# Altium schematic sheet 23-TEST AUTOMATION.SchDoc
size 513 x 386 mm
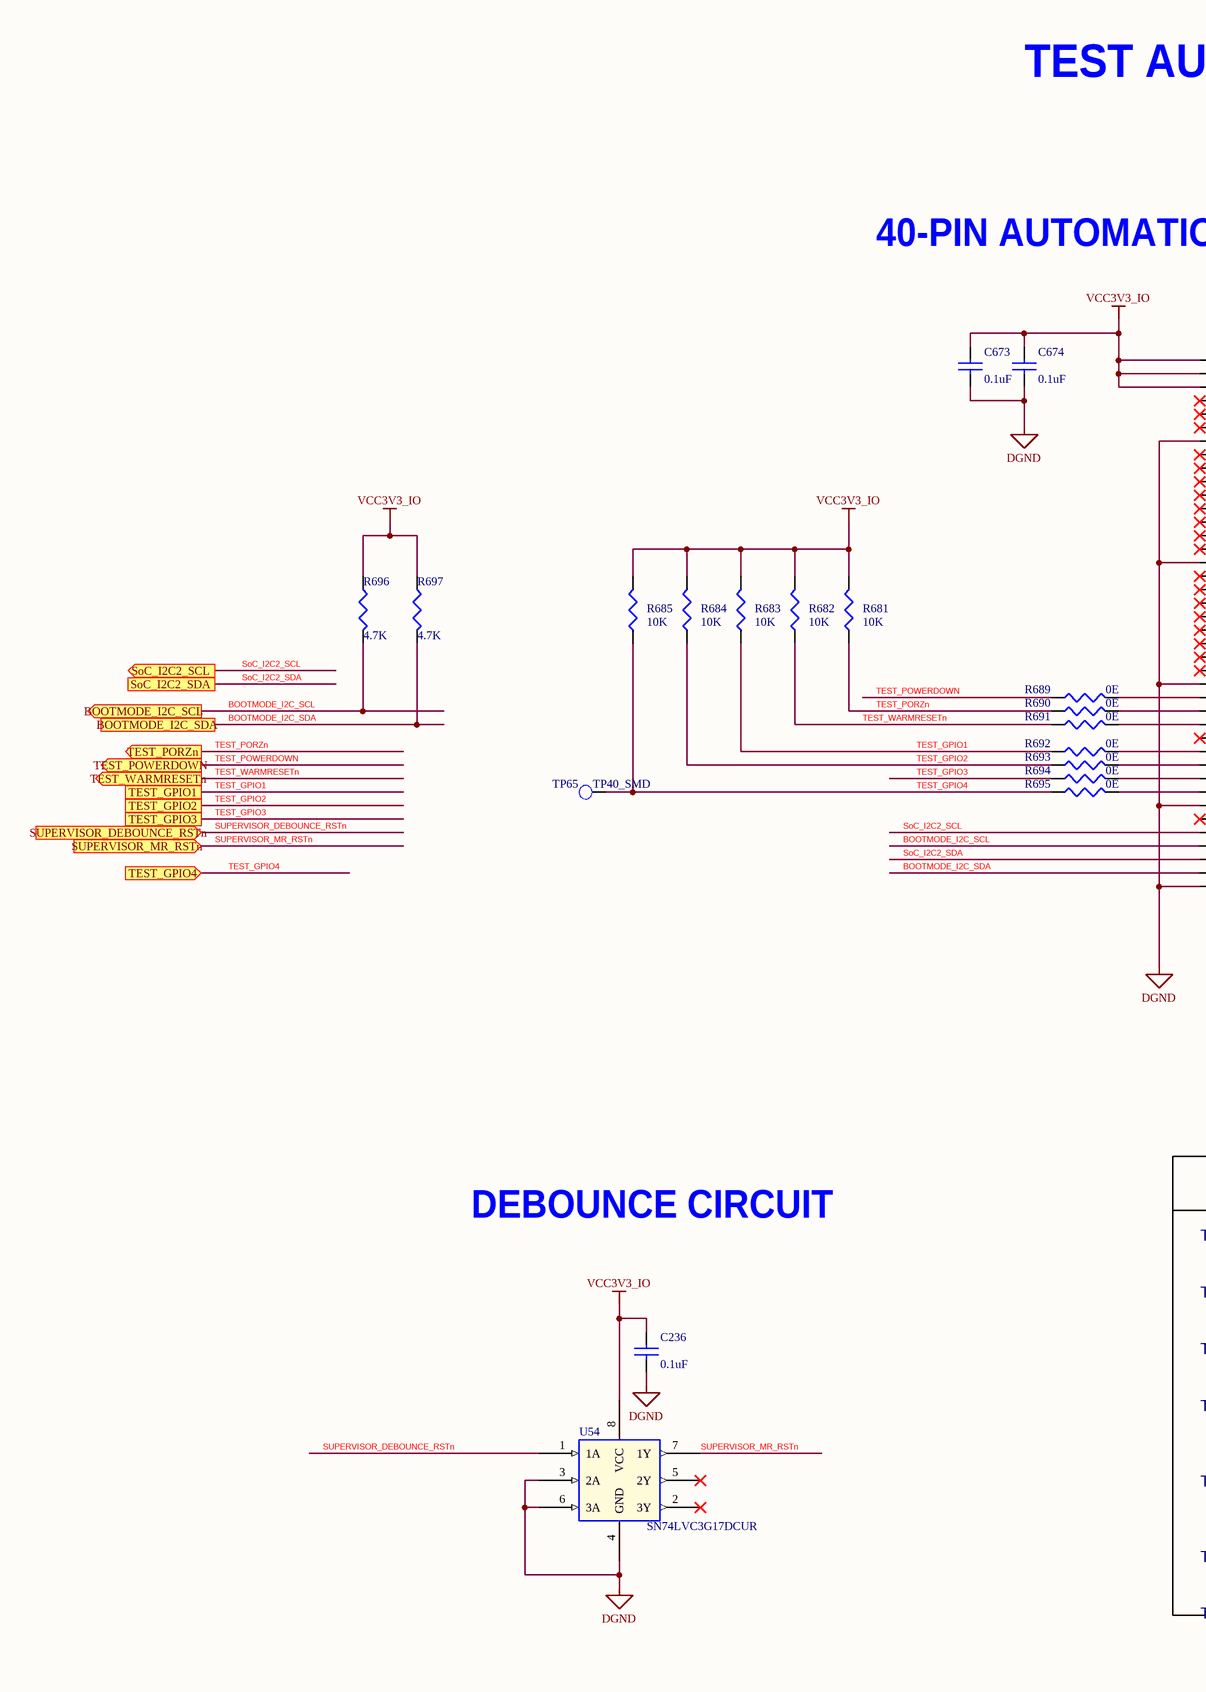
[diagram p0: 23-TEST AUTOMATION.SchDoc, left]
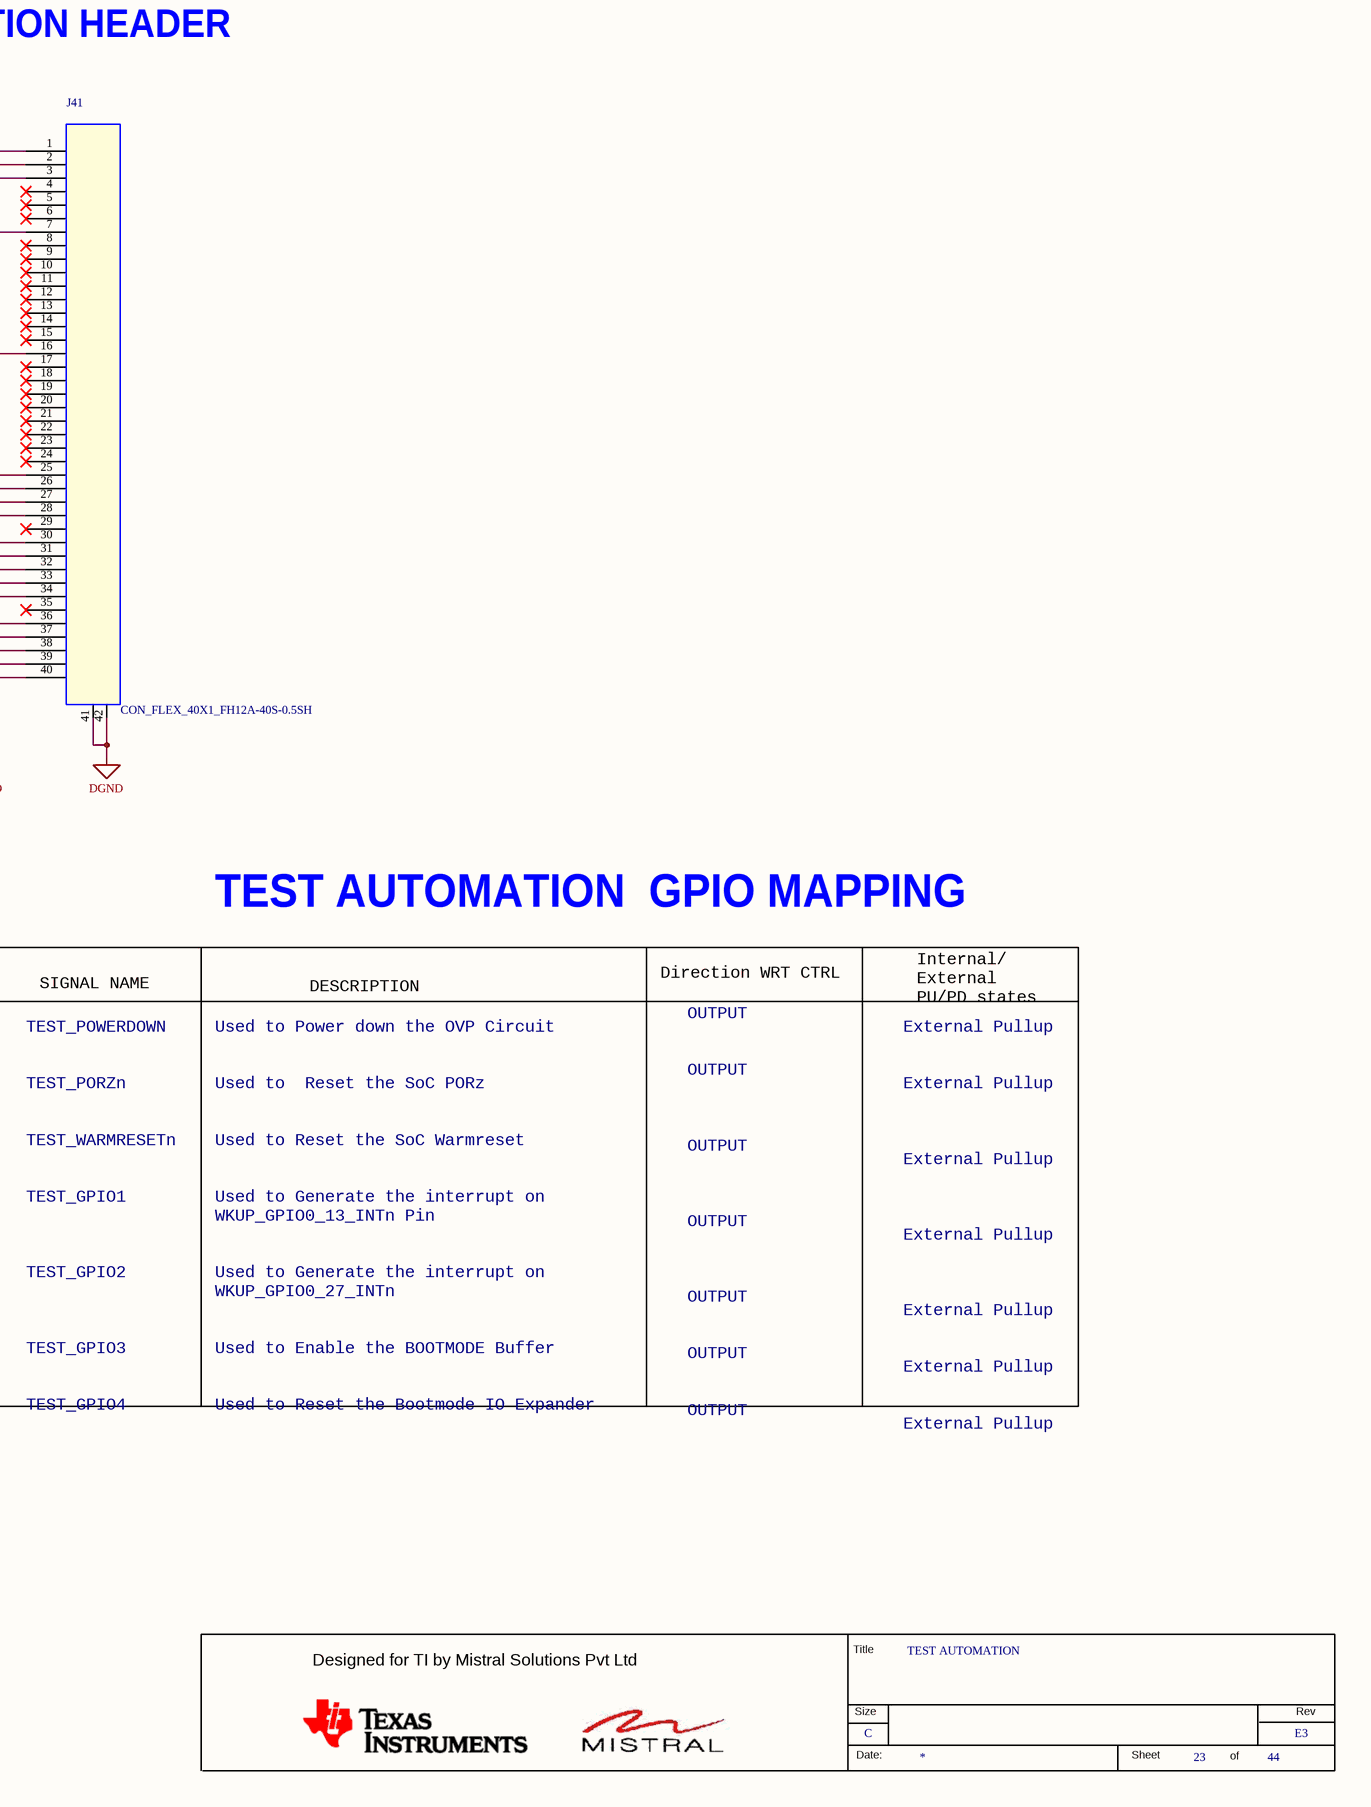
[diagram p1: 23-TEST AUTOMATION.SchDoc, right]

## Parts
*  RevCode: E3  Title: TEST AUTOMATION  Page Size: C  Page Number: 23  Page Count: 44  (hidden comment: MISTRAL_TITLEBLK_CSIZE)  (graphical)
C236  0.1uF  [CAP0201_0-5]
C673  0.1uF  [CAP0201_0-5]
C674  0.1uF  [CAP0201_0-5]
J41  CON_FLEX_40X1_FH12A-40S-0.5SH  [CON_FLEX40X1_FH12A_S_R_S]
R681  10K  [RES0402_0-5]
R682  10K  [RES0402_0-5]
R683  10K  [RES0402_0-5]
R684  10K  [RES0402_0-5]
R685  10K  [RES0402_0-5]
R689  0E  [RES0402_0-5]
R690  0E  [RES0402_0-5]
R691  0E  [RES0402_0-5]
R692  0E  [RES0402_0-5]
R693  0E  [RES0402_0-5]
R694  0E  [RES0402_0-5]
R695  0E  [RES0402_0-5]
R696  4.7K  [RES0402]
R697  4.7K  [RES0402]
TP65  TP40_SMD  [TP40_SMD]
U54  SN74LVC3G17DCUR  [VSSOP8_19-68_85X95_0-9]

## Ports
BOOTMODE_I2C_SCL (out), BOOTMODE_I2C_SDA, SoC_I2C2_SCL (out), SoC_I2C2_SDA, SUPERVISOR_DEBOUNCE_RSTn (in), SUPERVISOR_MR_RSTn (in), TEST_GPIO1, TEST_GPIO2, TEST_GPIO3, TEST_GPIO4 (in), TEST_PORZn (out), TEST_POWERDOWN (out), TEST_WARMRESETn (out)

## Nets
DGND: C236.2 C673.2 C674.2 J41.7 J41.16 J41.25 J41.34 J41.40 J41.41 J41.42 U54.3(2A) U54.4(GND) U54.6(3A)
VCC3V3_IO: C236.1 C673.1 C674.1 J41.1 J41.2 J41.3 R681.2 R682.2 R683.2 R684.2 R685.2 R696.1 R697.1 U54.8(VCC)
BOOTMODE_I2C_SCL: J41.37 R696.2 ; port BOOTMODE_I2C_SCL
BOOTMODE_I2C_SDA: J41.39 R697.2 ; port BOOTMODE_I2C_SDA
SoC_I2C2_SCL: J41.36 ; port SoC_I2C2_SCL
SoC_I2C2_SDA: J41.38 ; port SoC_I2C2_SDA
SUPERVISOR_DEBOUNCE_RSTn: U54.1(1A) ; port SUPERVISOR_DEBOUNCE_RSTn
SUPERVISOR_MR_RSTn: U54.7(1Y) ; port SUPERVISOR_MR_RSTn
TEST_GPIO1: R683.1 R692.1 ; port TEST_GPIO1
TEST_GPIO2: R684.1 R693.1 ; port TEST_GPIO2
TEST_GPIO3: R694.1 ; port TEST_GPIO3
TEST_GPIO4: R685.1 R695.1 TP65.1(TP) ; port TEST_GPIO4
TEST_PORZn: R681.1 R690.1 ; port TEST_PORZn
TEST_POWERDOWN: R689.1 ; port TEST_POWERDOWN
TEST_WARMRESETn: R682.1 R691.1 ; port TEST_WARMRESETn
NetJ41_26: J41.26 R689.2
NetJ41_27: J41.27 R690.2
NetJ41_28: J41.28 R691.2
NetJ41_30: J41.30 R692.2
NetJ41_31: J41.31 R693.2
NetJ41_32: J41.32 R694.2
NetJ41_33: J41.33 R695.2

Not connected (* = marked no-connect by the designer): J41 4* 5* 6* 8* 9* 10* 11* 12* 13* 14* 15* 17* 18* 19* 20* 21* 22* 23* 24* 29* 35*; U54 2(3Y)* 5(2Y)*

## Notes on the sheet
- TEST AUTOMATION
- 40-PIN AUTOMATION HEADER
- TEST AUTOMATION  GPIO MAPPING
- SIGNAL NAME
- Direction WRT CTRL
- Internal/
  External
  PU/PD states
- DEBOUNCE CIRCUIT
- DESCRIPTION
- TEST_POWERDOWN
  TEST_PORZn
  TEST_WARMRESETn
  TEST_GPIO1
  TEST_GPIO2
  TEST_GPIO3
  TEST_GPIO4
- OUTPUT
  OUTPUT
  OUTPUT
  OUTPUT
  OUTPUT
  OUTPUT
  OUTPUT
- External Pullup
  External Pullup
  External Pullup
  External Pullup
  External Pullup
  External Pullup
  External Pullup
- Used to Power down the OVP Circuit
  Used to  Reset the SoC PORz
  Used to Reset the SoC Warmreset
  Used to Generate the interrupt on
  WKUP_GPIO0_13_INTn Pin
  Used to Generate the interrupt on
  WKUP_GPIO0_27_INTn
  Used to Enable the BOOTMODE Buffer
  Used to Reset the Bootmode IO Expander
- (in symbol MISTRAL_TITLEBLK_CSIZE) Title; Designed for TI by Mistral Solutions Pvt Ltd; Size; Rev; Date:; Sheet; of

## Library data of the parts
* = MISTRAL_TITLEBLK_CSIZE: Issue: 1.0; Page Create Date: March  8, 1995; Page Modify Date: *
C236 C674 = CAP_Dup5: CAP CERAMIC 0.1uF 16V 10% X5R 0201; Mistral Part No: 120009030072-R; Mfr_name: MURATA; Mfr_part_number: GRM033R61C104KE84J; Part_type: CAPACITORS\CERAMIC; Project: TI_MAXIE_CPB; Wattage: NA; Customs_HS_Code: 85322990; Custom_Duty: 15%; Library Ref: CAP; Tolerance: 10%; Voltage: 16V; Package: 0201; Distributor_name: DIGIKEY; Distributor_part_number: 490-16742-1-ND; Height: 0.33MM; Weight: 0.33mg; Temperature: -55°C+85°C; Datasheet: Y:\MIS_DATABASE\DATASHEETS\CAPACITORS\GRM033R61C104KE84.PDF; Crtd /date: MANIRAJA/120218; Chkd/date: MANIRAJA/120218; MECHANICAL 3D STEP FILE: CAP0201_0-5; PCB Footprint: CAP0201_0-5
C673 = CAP_Dup5: CAP CERAMIC 0.1uF 16V 10% X5R 0201; Part_type: CAPACITORS\CERAMIC; Mfr_part_number: GRM033R61C104KE84J; Mfr_name: MURATA; Mistral Part No: 120009030072-R; Custom_Duty: 15%; Customs_HS_Code: 85322990; Wattage: NA; Project: TI_MAXIE_CPB; Library Ref: CAP; MECHANICAL 3D STEP FILE: CAP0201_0-5; Chkd/date: MANIRAJA/120218; Crtd /date: MANIRAJA/120218; Datasheet: Y:\MIS_DATABASE\DATASHEETS\CAPACITORS\GRM033R61C104KE84.PDF; Temperature: -55°C+85°C; Weight: 0.33mg; Height: 0.33MM; Distributor_part_number: 490-16742-1-ND; Distributor_name: DIGIKEY; Package: 0201; Voltage: 16V; Tolerance: 10%; PCB Footprint: CAP0201_0-5
J41 = CON_FLEX_40X1_FH12A-40S-0.5SH: CON FPC 40X1 0.50MM PITCH RT TOP SMD; Part_type: CONNECTOR\FPC; Mfr_part_number: FH12A-40S-0.5SH(55); Mfr_name: HIROSE ELECTRIC EUROPE; Mistral Part No: 150009030176-R; Remarks: CON_FLEX40X1_FH12A_S_R_S_PMP take this footprint for PMP LCD BOARD/ROHS INFORMATION ADDED(BAVISH/270911)Mistral part# updated with -R.; Custom_Duty: 24%; Customs_HS_Code: 85369090; Project: PMP LCD BOARD; Library Ref: CON_FLEX_40X1_FH12A-40S-0.5SH; Chkd/date: SHREESHAIL/201106; Crtd /date: MAZHAR/171106; Datasheet: Y:\MIS_DATABASE\DATASHEETS\CONNECTORS\FH12SERIES.PDF; Height: 2.00MM; Distributor_part_number: HFK40CT-ND; Distributor_name: DIGIKEY; Package: SMD; PCB Footprint: CON_FLEX40X1_FH12A_S_R_S
R681-R685 = RESISTOR_Dup5: RES 10K 1/16W 5% 0402; Mistral Part No: 110009030208-R; Mfr_name: YAGEO AMERICA; Mfr_part_number: RC0402JR-0710KL; Part_type: RESISTORS\FIXED; Project: HSE; Voltage: NA; Customs_HS_Code: 85332119; Custom_Duty: 15%; Footprint Path: Y:\MIS_DATABASE\Library\ALTIUM_TOOL\PCB_FOOTPRINTS\Altium_Footprint_Lib.PcbLib; Library Path: Y:\MIS_DATABASE\Library\ALTIUM_TOOL\SCHEMATICS_PARTS\MS_DISCRETE_Library.schlib; Footprint Ref: RES0402_0-5; Library Ref: RESISTOR; Tolerance: 5%; Wattage: 1/16W; Package: 0402; Distributor_name: DIGIKEY; Distributor_part_number: 311-10KJRCT-ND; Height: 0.40MM; Weight: 0.65mg; Temperature: -55°C+155°C; Datasheet: Y:\MIS_DATABASE\DATASHEETS\RESISTORS\YAGEO-RC0402.PDF; Crtd /date: MAZHAR/230805; Chkd/date: VASANTHA/061216; RoHS: Pb-Free; MECHANICAL 3D STEP FILE: RES0402_0-5; PCB Footprint: RES0402_0-5
R689 R691-R693 R695 = RESISTOR_Dup4: RES 0E 1/16W 0402; Part_type: RESISTORS\FIXED; Mfr_part_number: CRCW04020000Z0ED; Mfr_name: VISHAY; Mistral Part No: 110010080019-P; Custom_Duty: 15%; Customs_HS_Code: 85332119; Voltage: NA; Project: PB_BUGBASE; Footprint Path: Y:\MIS_DATABASE\Library\ALTIUM_TOOL\PCB_FOOTPRINTS\Altium_Footprint_Lib.PcbLib; Library Path: Y:\MIS_DATABASE\Library\ALTIUM_TOOL\SCHEMATICS_PARTS\MS_DISCRETE_Library.schlib; Footprint Ref: RES0402_0-5; Library Ref: RESISTOR; RoHS: Pb-Free; Chkd/date: VASANTHA/201216; Crtd /date: MUDDU/190810; Datasheet: Y:\MIS_DATABASE\DATASHEETS\RESISTORS\CRCW0603.PDF; Temperature: -55°C+155°C; Weight: 0.65g/1000pcs; Height: 0.40MM; Distributor_part_number: 541-0.0JCT-ND; Distributor_name: DIGIKEY; Package: 0402; Wattage: 1/16W; Tolerance: NA; MECHANICAL 3D STEP FILE: RES0402_0-5; PCB Footprint: RES0402_0-5
R690 R694 = RESISTOR_Dup4: RES 0E 1/16W 0402; Mistral Part No: 110010080019-P; Mfr_name: VISHAY; Mfr_part_number: CRCW04020000Z0ED; Part_type: RESISTORS\FIXED; Project: PB_BUGBASE; Tolerance: NA; Customs_HS_Code: 85332119; Custom_Duty: 15%; Footprint Path: Y:\MIS_DATABASE\Library\ALTIUM_TOOL\PCB_FOOTPRINTS\Altium_Footprint_Lib.PcbLib; Library Path: Y:\MIS_DATABASE\Library\ALTIUM_TOOL\SCHEMATICS_PARTS\MS_DISCRETE_Library.schlib; Footprint Ref: RES0402_0-5; Library Ref: RESISTOR; Voltage: NA; Wattage: 1/16W; Package: 0402; Distributor_name: DIGIKEY; Distributor_part_number: 541-0.0JCT-ND; Height: 0.40MM; Weight: 0.65g/1000pcs; Temperature: -55°C+155°C; Datasheet: Y:\MIS_DATABASE\DATASHEETS\RESISTORS\CRCW0603.PDF; Crtd /date: MUDDU/190810; Chkd/date: VASANTHA/201216; RoHS: Pb-Free; MECHANICAL 3D STEP FILE: RES0402_0-5; PCB Footprint: RES0402_0-5
R696 R697 = RESISTOR_Dup5: RES 4.7K 1/16W 5% 0402; Part_type: RESISTORS\FIXED; Mfr_part_number: RC0402JR-074K7L; Mfr_name: YAGEO AMERICA; Mistral Part No: 110009030792-R; Custom_Duty: 15%; Customs_HS_Code: 85332119; Voltage: NA; Project: TMDXCSK368; Library Ref: RESISTOR; Chkd/date: VASANTHA/130516; Crtd /date: VASANTHA/130516; Datasheet: Y:\MIS_DATABASE\DATASHEETS\RESISTORS\YAGEO-RC0402.PDF; Temperature: -55°C+155°C; Weight: NA; Height: 0.55MM; Distributor_part_number: 311-4.7KJRCT-ND; Distributor_name: DIGIKEY; Package: 0402; Wattage: 1/16W; Tolerance: 5%; PCB Footprint: RES0402
TP65 = TESTPOINT: TESTPOINT CIR 40 SMD; Mistral Part No: 130009030933; Mfr_name: LOCAL; Project: RAINIER-3; Tolerance: NA; NI_MARK: DNI; RoHS: NA; Footprint Ref: TP40_SMD; Library Ref: TESTPOINT; Mfr_part_number: TP40_SMD; Part_type: TESTPOINT; Package: SMD; Distributor_name: NA; Distributor_part_number: NA; Height: NA; Crtd /date: MAZHAR/190505; Chkd/date: MAZHAR/190505; Voltage: NA; Wattage: NA; Weight: NA; Temperature: NA; Datasheet: NA; MECHANICAL 3D STEP FILE: NA; Library Path: Y:\MIS_DATABASE\Library\ALTIUM_TOOL\SCHEMATICS_PARTS\MS_DISCRETE_Library.schlib; Footprint Path: Y:\MIS_DATABASE\Library\ALTIUM_TOOL\PCB_FOOTPRINTS\Altium_Footprint_Lib.PcbLib; PCB Footprint: TP40_SMD
U54 = SN74LVC3G17DCUR_VSSOP8: IC TRIPLE SCHMITT-TRIGGER BUFFER VSSOP8; Part_type: ICS\DIGITAL\COMBINATIONAL; Mfr_name: TEXAS INSTRUMENTS; Mistral Part No: 141017090019-R; Custom_Duty: 15%; Customs_HS_Code: 85423100; Wattage: NA; Project: TI_MAXIE_CPB; Library Ref: SN74LVC3G17DCUR_VSSOP8; MECHANICAL 3D STEP FILE: VSSOP8_19-68_85X95_0-9; Chkd/date: MANIRAJA/280917; Crtd /date: MANIRAJA/280917; Datasheet: Y:\MIS_DATABASE\DATASHEETS\ICS\DIGITAL\COMBINATIONAL\SN74LVC3G17.PDF; Temperature: -40°C+125°C; Weight: 9.6mg; Height: 0.90MM; Distributor_part_number: 296-18818-1-ND; Distributor_name: DIGIKEY; Package: VSSOP8; Voltage: NA; Tolerance: NA; Mfr_part_number: SN74LVC3G17DCUR; PCB Footprint: VSSOP8_19-68_85X95_0-9